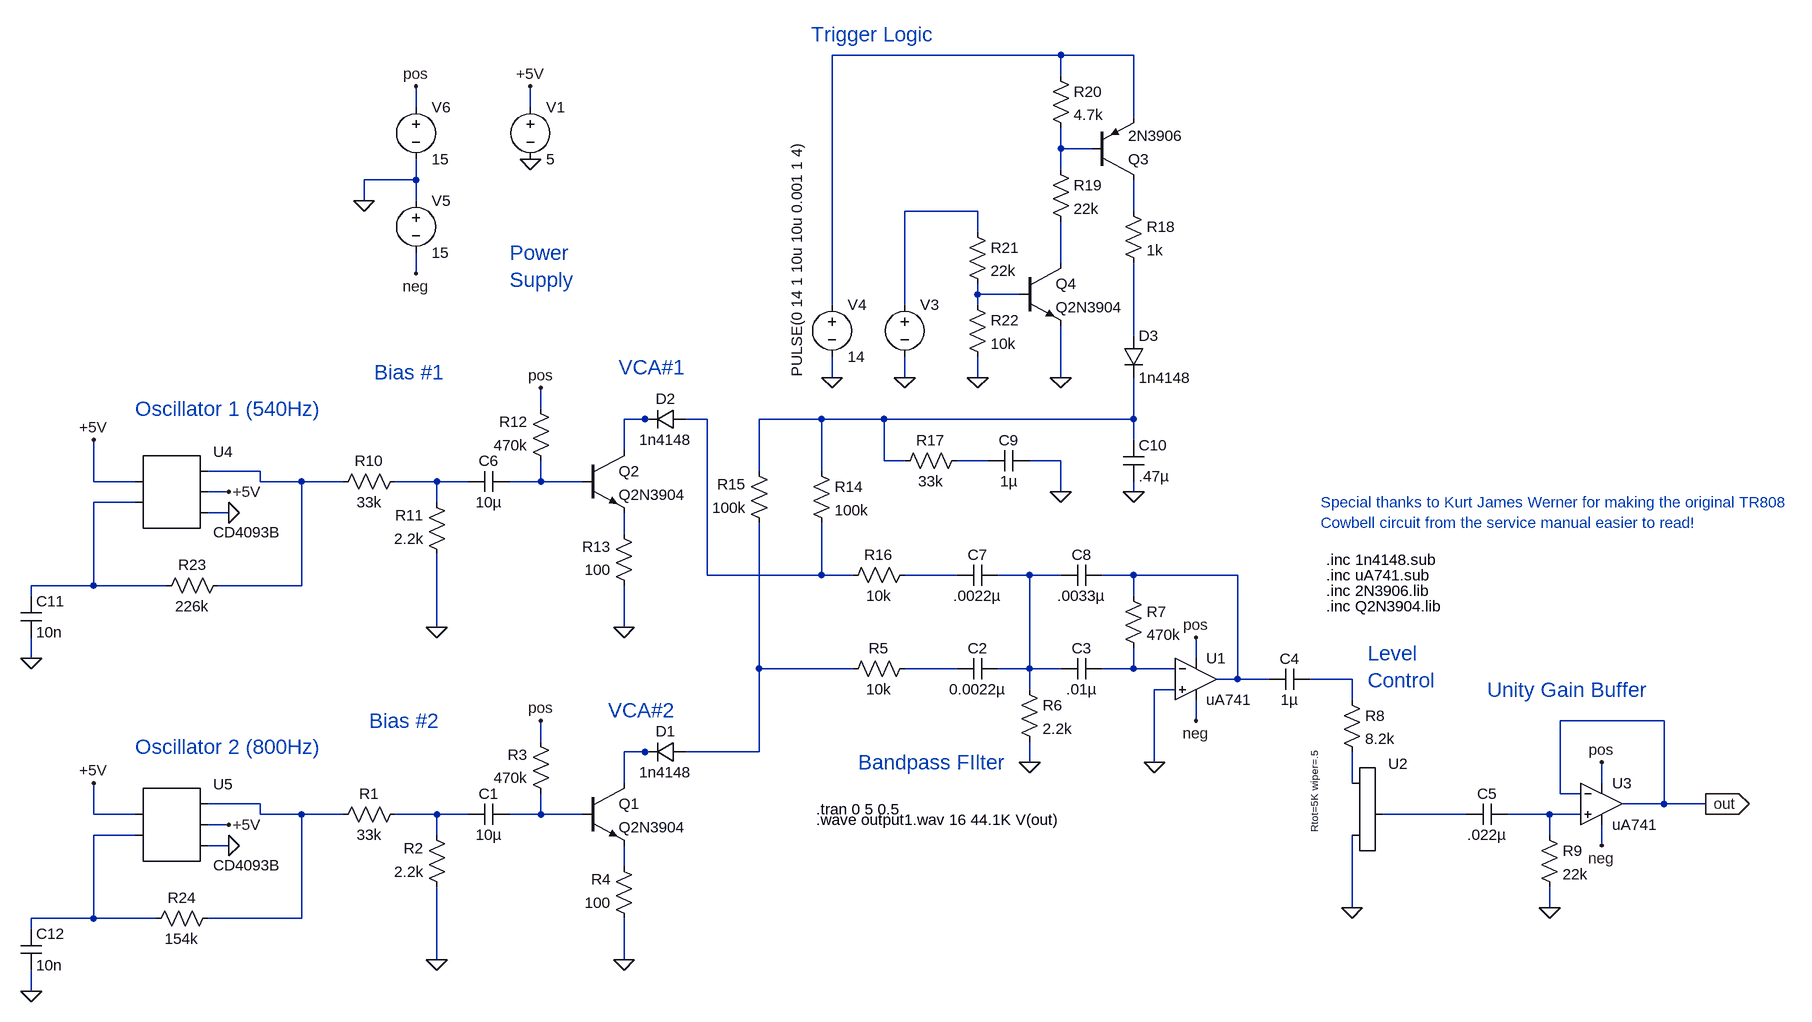
[diagram p0: schematic Cowbell - Schmitt.asc]
Cowbell - Schmitt.asc, the LTspice schematic file:
Version 4
SHEET 1 2344 680
WIRE 1184 -1040 832 -1040
WIRE 1296 -1040 1184 -1040
WIRE 1184 -1008 1184 -1040
WIRE 192 -960 192 -992
WIRE 368 -960 368 -992
WIRE 1296 -944 1296 -1040
WIRE 1184 -896 1184 -928
WIRE 1232 -896 1184 -896
WIRE 1184 -864 1184 -896
WIRE 192 -848 192 -880
WIRE 192 -848 112 -848
WIRE 112 -816 112 -848
WIRE 192 -816 192 -848
WIRE 1056 -800 944 -800
WIRE 1296 -800 1296 -848
WIRE 1056 -768 1056 -800
WIRE 1184 -720 1184 -784
WIRE 192 -704 192 -736
WIRE 1056 -672 1056 -688
WIRE 1120 -672 1056 -672
WIRE 832 -656 832 -1040
WIRE 944 -656 944 -800
WIRE 1056 -656 1056 -672
WIRE 1296 -608 1296 -720
WIRE 832 -544 832 -576
WIRE 944 -544 944 -576
WIRE 1056 -544 1056 -576
WIRE 1184 -544 1184 -624
WIRE 384 -496 384 -528
WIRE 544 -480 512 -480
WIRE 560 -480 544 -480
WIRE 640 -480 608 -480
WIRE 816 -480 720 -480
WIRE 912 -480 816 -480
WIRE 1296 -480 1296 -544
WIRE 1296 -480 912 -480
WIRE 1296 -448 1296 -480
WIRE 512 -432 512 -480
WIRE 912 -416 912 -480
WIRE 944 -416 912 -416
WIRE 1072 -416 1024 -416
WIRE 1184 -416 1136 -416
WIRE -48 -400 -128 -400
WIRE 720 -400 720 -480
WIRE 816 -400 816 -480
WIRE -304 -384 -304 -448
WIRE -240 -384 -304 -384
WIRE -48 -384 -48 -400
WIRE 16 -384 -48 -384
WIRE 80 -384 16 -384
WIRE 224 -384 160 -384
WIRE 272 -384 224 -384
WIRE 384 -384 384 -416
WIRE 384 -384 336 -384
WIRE 448 -384 384 -384
WIRE -96 -368 -128 -368
WIRE 1184 -368 1184 -416
WIRE 1296 -368 1296 -384
WIRE -240 -352 -304 -352
WIRE 224 -352 224 -384
WIRE -96 -336 -128 -336
WIRE 512 -304 512 -336
WIRE 640 -240 640 -480
WIRE 816 -240 816 -320
WIRE 816 -240 640 -240
WIRE 864 -240 816 -240
WIRE 1024 -240 944 -240
WIRE 1136 -240 1088 -240
WIRE 1184 -240 1136 -240
WIRE 1296 -240 1248 -240
WIRE 1456 -240 1296 -240
WIRE -304 -224 -304 -352
WIRE -304 -224 -400 -224
WIRE -192 -224 -304 -224
WIRE 16 -224 16 -384
WIRE 16 -224 -112 -224
WIRE -400 -208 -400 -224
WIRE 1296 -208 1296 -240
WIRE 224 -160 224 -272
WIRE 512 -160 512 -224
WIRE -400 -112 -400 -144
WIRE 1392 -112 1392 -144
WIRE 720 -96 720 -320
WIRE 864 -96 720 -96
WIRE 1024 -96 944 -96
WIRE 1136 -96 1136 -240
WIRE 1136 -96 1088 -96
WIRE 1184 -96 1136 -96
WIRE 1296 -96 1296 -128
WIRE 1296 -96 1248 -96
WIRE 1360 -96 1296 -96
WIRE 1456 -80 1456 -240
WIRE 1456 -80 1424 -80
WIRE 1504 -80 1456 -80
WIRE 1632 -80 1568 -80
WIRE 1136 -64 1136 -96
WIRE 1360 -64 1328 -64
WIRE 1632 -48 1632 -80
WIRE 1392 -16 1392 -48
WIRE 2112 -16 1952 -16
WIRE 384 16 384 -16
WIRE 544 32 512 32
WIRE 560 32 544 32
WIRE 720 32 720 -96
WIRE 720 32 608 32
WIRE 1136 48 1136 16
WIRE 1328 48 1328 -64
WIRE 512 80 512 32
WIRE 1632 80 1632 32
WIRE 2016 80 2016 48
WIRE 1952 96 1952 -16
WIRE 1984 96 1952 96
WIRE -48 112 -128 112
WIRE 2112 112 2112 -16
WIRE 2112 112 2048 112
WIRE 2176 112 2112 112
WIRE -304 128 -304 80
WIRE -240 128 -304 128
WIRE -48 128 -48 112
WIRE 16 128 -48 128
WIRE 80 128 16 128
WIRE 224 128 160 128
WIRE 272 128 224 128
WIRE 384 128 384 96
WIRE 384 128 336 128
WIRE 448 128 384 128
WIRE 1808 128 1680 128
WIRE 1936 128 1872 128
WIRE 1984 128 1936 128
WIRE -96 144 -128 144
WIRE -240 160 -304 160
WIRE 224 160 224 128
WIRE 1936 160 1936 128
WIRE -96 176 -128 176
WIRE 2016 176 2016 144
WIRE 512 208 512 176
WIRE 1632 272 1632 160
WIRE 1936 272 1936 240
WIRE -304 288 -304 160
WIRE -304 288 -400 288
WIRE -208 288 -304 288
WIRE 16 288 16 128
WIRE 16 288 -128 288
WIRE -400 304 -400 288
WIRE 224 352 224 240
WIRE 512 352 512 288
WIRE -400 400 -400 368
FLAG 224 352 0
FLAG 512 352 0
FLAG 1632 272 0
FLAG 1936 272 0
FLAG 224 -160 0
FLAG 512 -160 0
FLAG 1136 48 0
FLAG 1328 48 0
FLAG 1184 -368 0
FLAG 1296 -368 0
FLAG 832 -544 0
FLAG 944 -544 0
FLAG 1056 -544 0
FLAG 1184 -544 0
FLAG 112 -816 0
FLAG 192 -992 pos
FLAG 192 -704 neg
FLAG 384 -528 pos
FLAG 384 -16 pos
FLAG 2176 112 out
IOPIN 2176 112 Out
FLAG 2016 48 pos
FLAG 1392 -144 pos
FLAG 2016 176 neg
FLAG 1392 -16 neg
FLAG 368 -880 0
FLAG 368 -992 +5V
FLAG -304 -448 +5V
FLAG -304 80 +5V
FLAG -400 -112 0
FLAG -400 400 0
FLAG -96 -336 0
FLAG -96 -368 +5V
FLAG -96 176 0
FLAG -96 144 +5V
SYMBOL res 176 112 R90
WINDOW 0 0 56 VBottom 2
WINDOW 3 32 56 VTop 2
SYMATTR InstName R1
SYMATTR Value 33k
SYMBOL res 240 256 R180
WINDOW 0 36 76 Left 2
WINDOW 3 36 40 Left 2
SYMATTR InstName R2
SYMATTR Value 2.2k
SYMBOL res 400 112 R180
WINDOW 0 36 76 Left 2
WINDOW 3 36 40 Left 2
SYMATTR InstName R3
SYMATTR Value 470k
SYMBOL res 528 304 R180
WINDOW 0 36 76 Left 2
WINDOW 3 36 40 Left 2
SYMATTR InstName R4
SYMATTR Value 100
SYMBOL npn 448 80 R0
SYMATTR InstName Q1
SYMATTR Value Q2N3904
SYMBOL cap 336 112 R90
WINDOW 0 0 32 VBottom 2
WINDOW 3 32 32 VTop 2
SYMATTR InstName C1
SYMATTR Value 10µ
SYMBOL diode 608 16 R90
WINDOW 0 0 32 VBottom 2
WINDOW 3 32 32 VTop 2
SYMATTR InstName D1
SYMATTR Value 1n4148
SYMATTR Prefix X
SYMBOL cap 1088 -112 R90
WINDOW 0 0 32 VBottom 2
WINDOW 3 32 32 VTop 2
SYMATTR InstName C2
SYMATTR Value 0.0022µ
SYMBOL res 1120 -80 R0
SYMATTR InstName R6
SYMATTR Value 2.2k
SYMBOL cap 1248 -112 R90
WINDOW 0 0 32 VBottom 2
WINDOW 3 32 32 VTop 2
SYMATTR InstName C3
SYMATTR Value .01µ
SYMBOL res 1280 -224 R0
SYMATTR InstName R7
SYMATTR Value 470k
SYMBOL Opamps\\opamp2 1392 -144 R0
SYMATTR InstName U1
SYMATTR Value uA741
SYMBOL cap 1568 -96 R90
WINDOW 0 0 32 VBottom 2
WINDOW 3 32 32 VTop 2
SYMATTR InstName C4
SYMATTR Value 1µ
SYMBOL res 1616 -64 R0
SYMATTR InstName R8
SYMATTR Value 8.2k
SYMBOL potentiometer_standard 1616 64 R0
WINDOW 3 -42 -32 VRight 1
WINDOW 39 -21 -17 VRight 1
SYMATTR Value Rtot=5K wiper=.5
SYMATTR InstName U2
SYMATTR SpiceModel pot_pow
SYMBOL cap 1872 112 R90
WINDOW 0 0 32 VBottom 2
WINDOW 3 32 32 VTop 2
SYMATTR InstName C5
SYMATTR Value .022µ
SYMBOL res 1920 144 R0
SYMATTR InstName R9
SYMATTR Value 22k
SYMBOL Opamps\\opamp2 2016 48 R0
SYMATTR InstName U3
SYMATTR Value uA741
SYMBOL res 176 -400 R90
WINDOW 0 0 56 VBottom 2
WINDOW 3 32 56 VTop 2
SYMATTR InstName R10
SYMATTR Value 33k
SYMBOL res 240 -256 R180
WINDOW 0 36 76 Left 2
WINDOW 3 36 40 Left 2
SYMATTR InstName R11
SYMATTR Value 2.2k
SYMBOL res 400 -400 R180
WINDOW 0 36 76 Left 2
WINDOW 3 36 40 Left 2
SYMATTR InstName R12
SYMATTR Value 470k
SYMBOL res 528 -208 R180
WINDOW 0 36 76 Left 2
WINDOW 3 36 40 Left 2
SYMATTR InstName R13
SYMATTR Value 100
SYMBOL npn 448 -432 R0
SYMATTR InstName Q2
SYMATTR Value Q2N3904
SYMBOL cap 336 -400 R90
WINDOW 0 0 32 VBottom 2
WINDOW 3 32 32 VTop 2
SYMATTR InstName C6
SYMATTR Value 10µ
SYMBOL diode 608 -496 R90
WINDOW 0 0 32 VBottom 2
WINDOW 3 32 32 VTop 2
SYMATTR InstName D2
SYMATTR Value 1n4148
SYMATTR Prefix X
SYMBOL res 736 -304 R180
WINDOW 0 36 76 Left 2
WINDOW 3 36 40 Left 2
SYMATTR InstName R15
SYMATTR Value 100k
SYMBOL res 800 -416 R0
SYMATTR InstName R14
SYMATTR Value 100k
SYMBOL res 960 -256 R90
WINDOW 0 0 56 VBottom 2
WINDOW 3 32 56 VTop 2
SYMATTR InstName R16
SYMATTR Value 10k
SYMBOL cap 1088 -256 R90
WINDOW 0 0 32 VBottom 2
WINDOW 3 32 32 VTop 2
SYMATTR InstName C7
SYMATTR Value .0022µ
SYMBOL cap 1248 -256 R90
WINDOW 0 0 32 VBottom 2
WINDOW 3 32 32 VTop 2
SYMATTR InstName C8
SYMATTR Value .0033µ
SYMBOL res 960 -112 R90
WINDOW 0 0 56 VBottom 2
WINDOW 3 32 56 VTop 2
SYMATTR InstName R5
SYMATTR Value 10k
SYMBOL res 1040 -432 R90
WINDOW 0 0 56 VBottom 2
WINDOW 3 32 56 VTop 2
SYMATTR InstName R17
SYMATTR Value 33k
SYMBOL cap 1136 -432 R90
WINDOW 0 0 32 VBottom 2
WINDOW 3 32 32 VTop 2
SYMATTR InstName C9
SYMATTR Value 1µ
SYMBOL cap 1280 -448 R0
SYMATTR InstName C10
SYMATTR Value .47µ
SYMBOL diode 1280 -608 R0
SYMATTR InstName D3
SYMATTR Value 1n4148
SYMATTR Prefix X
SYMBOL res 1280 -816 R0
SYMATTR InstName R18
SYMATTR Value 1k
SYMBOL res 1168 -880 R0
SYMATTR InstName R19
SYMATTR Value 22k
SYMBOL res 1168 -1024 R0
SYMATTR InstName R20
SYMATTR Value 4.7k
SYMBOL npn 1120 -720 R0
SYMATTR InstName Q4
SYMATTR Value Q2N3904
SYMBOL res 1040 -784 R0
SYMATTR InstName R21
SYMATTR Value 22k
SYMBOL res 1040 -672 R0
SYMATTR InstName R22
SYMATTR Value 10k
SYMBOL voltage 944 -672 R0
WINDOW 3 -166 -237 VRight 2
WINDOW 123 0 0 Left 0
WINDOW 39 0 0 Left 0
SYMATTR Value PULSE(0 14 1 10u 10u 0.001 1 4)
SYMATTR InstName V3
SYMBOL voltage 832 -672 R0
WINDOW 123 0 0 Left 0
WINDOW 39 0 0 Left 0
SYMATTR InstName V4
SYMATTR Value 14
SYMBOL voltage 192 -832 R0
WINDOW 123 0 0 Left 0
WINDOW 39 0 0 Left 0
SYMATTR InstName V5
SYMATTR Value 15
SYMBOL voltage 192 -976 R0
WINDOW 123 0 0 Left 0
WINDOW 39 0 0 Left 0
SYMATTR InstName V6
SYMATTR Value 15
SYMBOL pnp 1232 -848 M180
SYMATTR InstName Q3
SYMATTR Value 2N3906
SYMBOL voltage 368 -976 R0
WINDOW 123 0 0 Left 0
WINDOW 39 0 0 Left 0
SYMATTR InstName V1
SYMATTR Value 5
SYMBOL cap -416 -208 R0
SYMATTR InstName C11
SYMATTR Value 10n
SYMBOL res -96 -240 R90
WINDOW 0 0 56 VBottom 2
WINDOW 3 32 56 VTop 2
SYMATTR InstName R23
SYMATTR Value 226k
SYMBOL res -112 272 R90
WINDOW 0 0 56 VBottom 2
WINDOW 3 32 56 VTop 2
SYMATTR InstName R24
SYMATTR Value 154k
SYMBOL cap -416 304 R0
SYMATTR InstName C12
SYMATTR Value 10n
SYMBOL AutoGenerated\\CD4093B -192 -368 R0
WINDOW 39 68 201 Top 2
SYMATTR InstName U4
SYMBOL AutoGenerated\\CD4093B -192 144 R0
WINDOW 39 43 198 Top 2
SYMATTR InstName U5
TEXT 1592 -192 Left 2 !.inc Q2N3904.lib
TEXT 1584 -352 Left 2 ;Special thanks to Kurt James Werner for making the original TR808\nCowbell circuit from the service manual easier to read!
TEXT 1592 -264 Left 2 !.inc 1n4148.sub
TEXT 1592 -240 Left 2 !.inc uA741.sub
TEXT 808 120 Left 2 !.tran 0 5 0.5
TEXT 808 136 Left 2 !.wave output1.wav 16 44.1K V(out)
TEXT 800 -1072 Left 3 ;Trigger Logic
TEXT -240 -496 Left 3 ;Oscillator 1 (540Hz)
TEXT -240 24 Left 3 ;Oscillator 2 (800Hz)
TEXT 1592 -216 Left 2 !.inc 2N3906.lib
TEXT 336 -736 Left 3 ;Power\nSupply
TEXT 128 -552 Left 3 ;Bias #1
TEXT 120 -16 Left 3 ;Bias #2
TEXT 504 -560 Left 3 ;VCA#1
TEXT 488 -32 Left 3 ;VCA#2
TEXT 872 48 Left 3 ;Bandpass FIlter
TEXT 1656 -120 Left 3 ;Level \nControl
TEXT 1840 -64 Left 3 ;Unity Gain Buffer

The netlist it stands for:
* Cowbell - Schmitt.asc
R1 N027 N026 33k
R2 0 N027 2.2k
R3 N028 pos 470k
R4 0 N032 100
Q1 N024 N028 N032 0 Q2N3904
C1 N028 N027 10µ
XD1 N020 N024 1n4148  ; pins + -
C2 N018 N021 0.0022µ
R6 N018 0 2.2k
C3 N022 N018 .01µ
R7 N019 N022 470k
XU1 0 N022 pos neg N019 uA741  ; pins In+ In- V+ V- OUT
C4 N023 N019 1µ
R8 N023 N025 8.2k
XU2 N025 0 N029 pot_pow Rtot=5K wiper=.5
C5 N030 N029 .022µ
R9 N030 0 22k
XU3 N030 out pos neg out uA741  ; pins In+ In- V+ V- OUT
R10 N013 N012 33k
R11 0 N013 2.2k
R12 N014 pos 470k
R13 0 N016 100
Q2 N008 N014 N016 0 Q2N3904
C6 N014 N013 10µ
XD2 N009 N008 1n4148  ; pins + -
R15 N020 N010 100k
R14 N010 N009 100k
R16 N017 N009 10k
C7 N018 N017 .0022µ
C8 N019 N018 .0033µ
R5 N021 N020 10k
R17 N011 N010 33k
C9 0 N011 1µ
C10 N010 0 .47µ
XD3 N007 N010 1n4148  ; pins + -
R18 N004 N007 1k
R19 N002 N005 22k
R20 N001 N002 4.7k
Q4 N005 N006 0 0 Q2N3904
R21 N003 N006 22k
R22 N006 0 10k
V3 N003 0 PULSE(0 14 1 10u 10u 0.001 1 4)
V4 N001 0 14
V5 0 neg 15
V6 pos 0 15
Q3 N004 N002 N001 0 2N3906
V1 +5V 0 5
C11 N015 0 10n
R23 N012 N015 226k
R24 N026 N031 154k
C12 N031 0 10n
* U4: CD4093B (symbol AutoGenerated\CD4093B not available, pins judged from their places): pin1=+5V pin2=N015 pin3=N012 pin4=+5V pin5=0
* U5: CD4093B (symbol AutoGenerated\CD4093B not available, pins judged from their places): pin1=+5V pin2=N031 pin3=N026 pin4=+5V pin5=0
.model NPN NPN
.model PNP PNP
.lib standard.bjt
.inc Q2N3904.lib
* Special thanks to Kurt James Werner for making the original TR808
* Cowbell circuit from the service manual easier to read!
.inc 1n4148.sub
.inc uA741.sub
.tran 0 5 0.5
.wave output1.wav 16 44.1K V(out)
* Trigger Logic
* Oscillator 1 (540Hz)
* Oscillator 2 (800Hz)
.inc 2N3906.lib
* Power
* Supply
* Bias #1
* Bias #2
* VCA#1
* VCA#2
* Bandpass FIlter
* Level
* Control
* Unity Gain Buffer
.backanno
.end